# EasyEDA schematic 1-Schematic_SPL_Watermelon_Elektrobox.json
TITLE: Elektrobox; REV: 1.0; Date: 2026-01-30; Sheet: 1/1; Drawn By: emil.kappel2008; Company: 3BHWII Apfel GmbH (Julian, Emil)
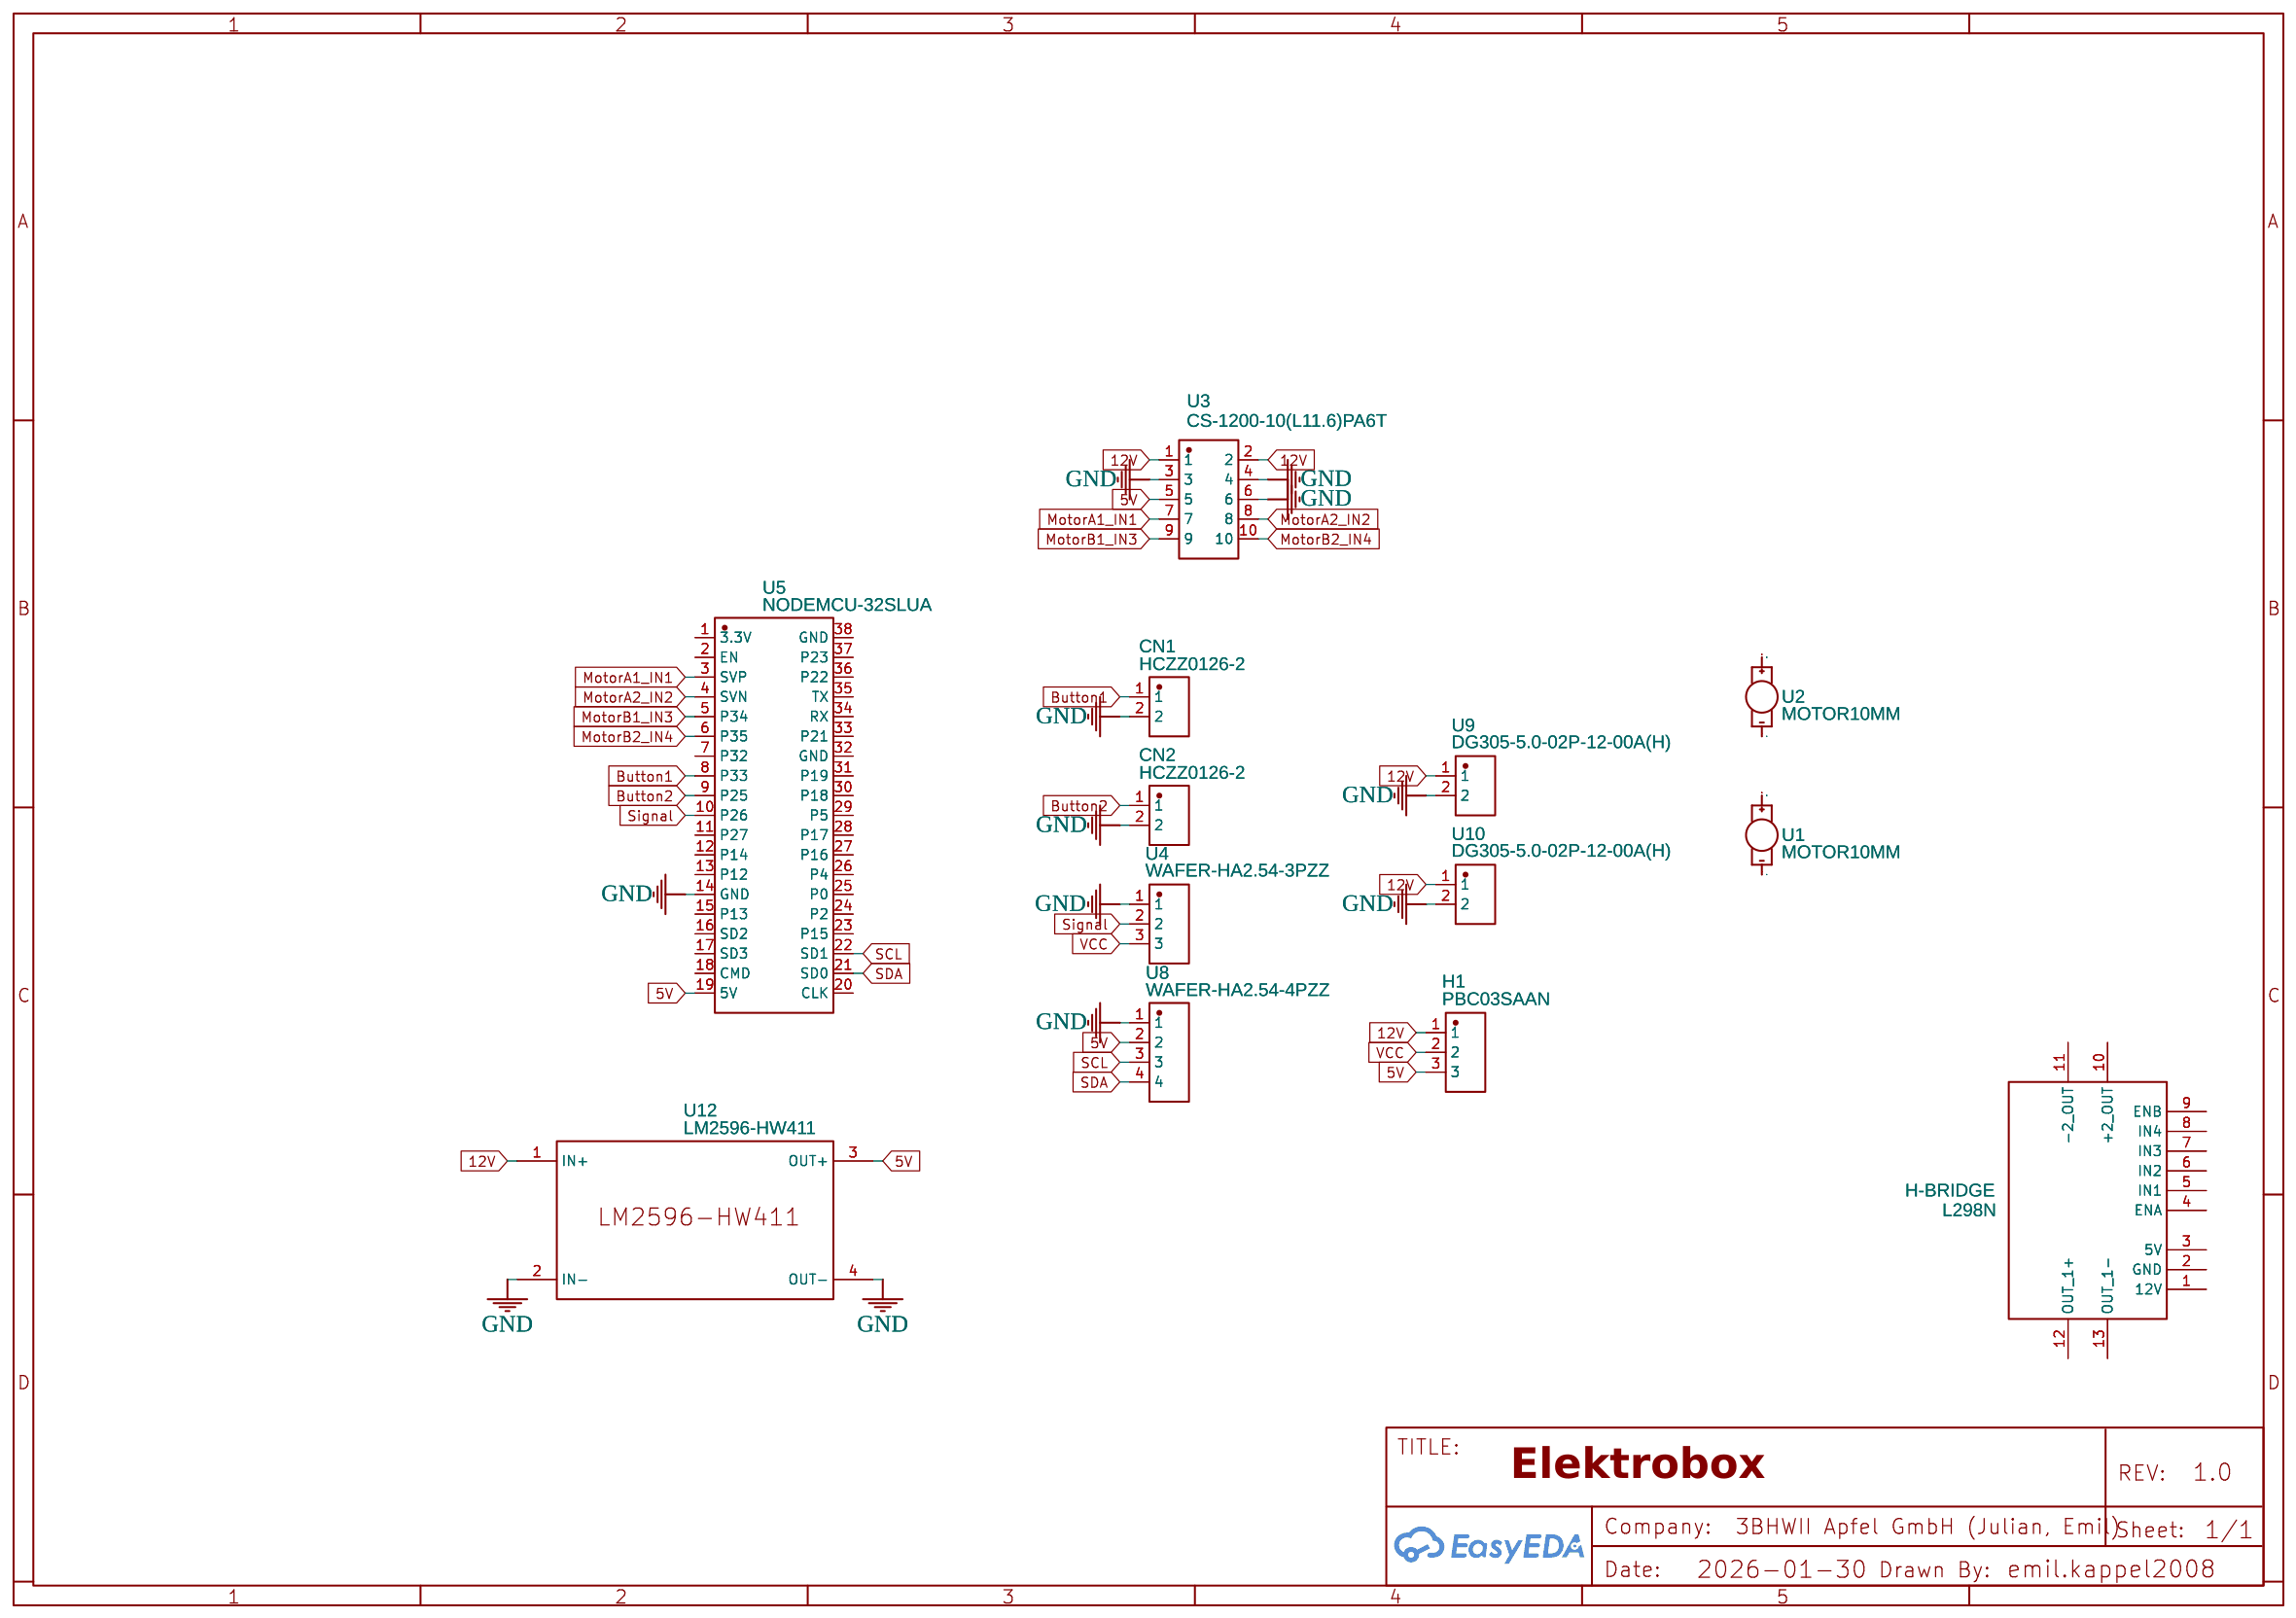
[diagram p0: schematic sheet]

## Parts
CN1  HCZZ0126-2  [CONN-TH_2P-P2.54_HDR2]
CN2  HCZZ0126-2  [CONN-TH_2P-P2.54_HDR2]
H1  PBC03SAAN  [HDR-TH_3P-P2.54-V-M-B]
H-BRIDGE  L298N  [L298N DUAL H-BRIDGE MOTOR DRIVER MODULE]
U1  MOTOR10MM  [VIBE-MOTOR-10MM]
U2  MOTOR10MM  [VIBE-MOTOR-10MM]
U3  CS-1200-10(L11.6)PA6T  [CONN-TH_10P-P2.54_CST_CS-1200-10]
U4  WAFER-HA2.54-3PZZ  [CONN-TH_3P-P2.54_WAFER-HA2.54-3PZZ]
U5  NODEMCU-32SLUA  [COMM-TH_NODEMCU-32SLUA]
U8  WAFER-HA2.54-4PZZ  [CONN-TH_4P-P2.50-XH2.54-4P]
U9  DG305-5.0-02P-12-00A(H)  [CONN-TH_2P-P2.50_DG305-5.0-02P-12-00A-H]
U10  DG305-5.0-02P-12-00A(H)  [CONN-TH_2P-P2.50_DG305-5.0-02P-12-00A-H]
U12  LM2596-HW411  [LM2596 HW411]

## Library data of the parts
CN1 CN2 = HCZZ0126-2: Supplier: LCSC; Supplier Part: C7433752; Manufacturer: HC(虹成电子); JLCPCB Part Class: Extended Part; Contributor: lcsc
H1 = PBC03SAAN: Contributor: lcsc; Supplier: LCSC; Supplier Part: C3333754; Manufacturer: Sullins; JLCPCB Part Class: Extended Part
H-BRIDGE = L298N DUAL H-BRIDGE MOTOR DRIVER MODULE: Contributor: Ismael Cabral
U1 U2 = MOTOR10MM: Vibration Motor- ROB-08449; Contributor: SparkFun
U3 = CS-1200-10(L11.6)PA6T: Supplier: LCSC; Supplier Part: C18214196; Manufacturer: CST(永丰盈); Contributor: lcsc; JLCPCB Part Class: Extended Part
U4 = WAFER-HA2.54-3PZZ: Contributor: lcsc; Supplier: LCSC; Supplier Part: C5374807; Manufacturer: XUNPU(讯普); JLCPCB Part Class: Extended Part
U5 = NODEMCU-32SLUA: Contributor: lcsc; Supplier: LCSC; Supplier Part: C111436; Manufacturer: Ai-Thinker(安信可); Manufacturer Part: NodeMCU-32SLua; JLCPCB Part Class: Extended Part
U8 = WAFER-HA2.54-4PZZ: Supplier: LCSC; Supplier Part: C5359651; Manufacturer: XUNPU(讯普); Contributor: lcsc; JLCPCB Part Class: Extended Part
U9 U10 = DG305-5.0-02P-12-00A(H): Supplier: LCSC; Supplier Part: C5632695; Manufacturer: DEGSON(高正/高松); JLCPCB Part Class: Extended Part; Contributor: lcsc
U12 = LM2596-HW411: Supplier Part: LM2596 HW-411; Contributor: MikeKingdom

## Nets
5V: H1.3 U3.5 U5.19(5V) U8.2 U12.3(OUT+)
12V: H1.1 U3.1 U3.2 U9.1 U10.1 U12.1(IN+)
GND: CN1.2 CN2.2 U3.3 U3.4 U3.6 U4.1 U5.14(GND) U8.1 U9.2 U10.2 U12.2(IN-) U12.4(OUT-)
VCC: H1.2 U4.3
Button1: CN1.1 U5.8(P33)
Button2: CN2.1 U5.9(P25)
MotorA1_IN1: U3.7 U5.3(SVP)
MotorA2_IN2: U3.8 U5.4(SVN)
MotorB1_IN3: U3.9 U5.5(P34)
MotorB2_IN4: U3.10 U5.6(P35)
SCL: U5.22(SD1) U8.3
SDA: U5.21(SD0) U8.4
Signal: U4.2 U5.10(P26)

Not connected (* = marked no-connect by the designer): H-BRIDGE 1(12V) 2(GND) 3(5V) 4(ENA) 5(IN1) 6(IN2) 7(IN3) 8(IN4) 9(ENB) 10(+2_OUT) 11(-2_OUT) 12(OUT_1+) 13(OUT_1-); U1 + -; U2 + -; U5 1(3.3V) 2(EN) 7(P32) 11(P27) 12(P14) 13(P12) 15(P13) 16(SD2) 17(SD3) 18(CMD) 20(CLK) 23(P15) 24(P2) 25(P0) 26(P4) 27(P16) 28(P17) 29(P5) 30(P18) 31(P19) 32(GND) 33(P21) 34(RX) 35(TX) 36(P22) 37(P23) 38(GND)
